# Altium schematic sheet SM2200.SchDoc
size 406 x 228 mm
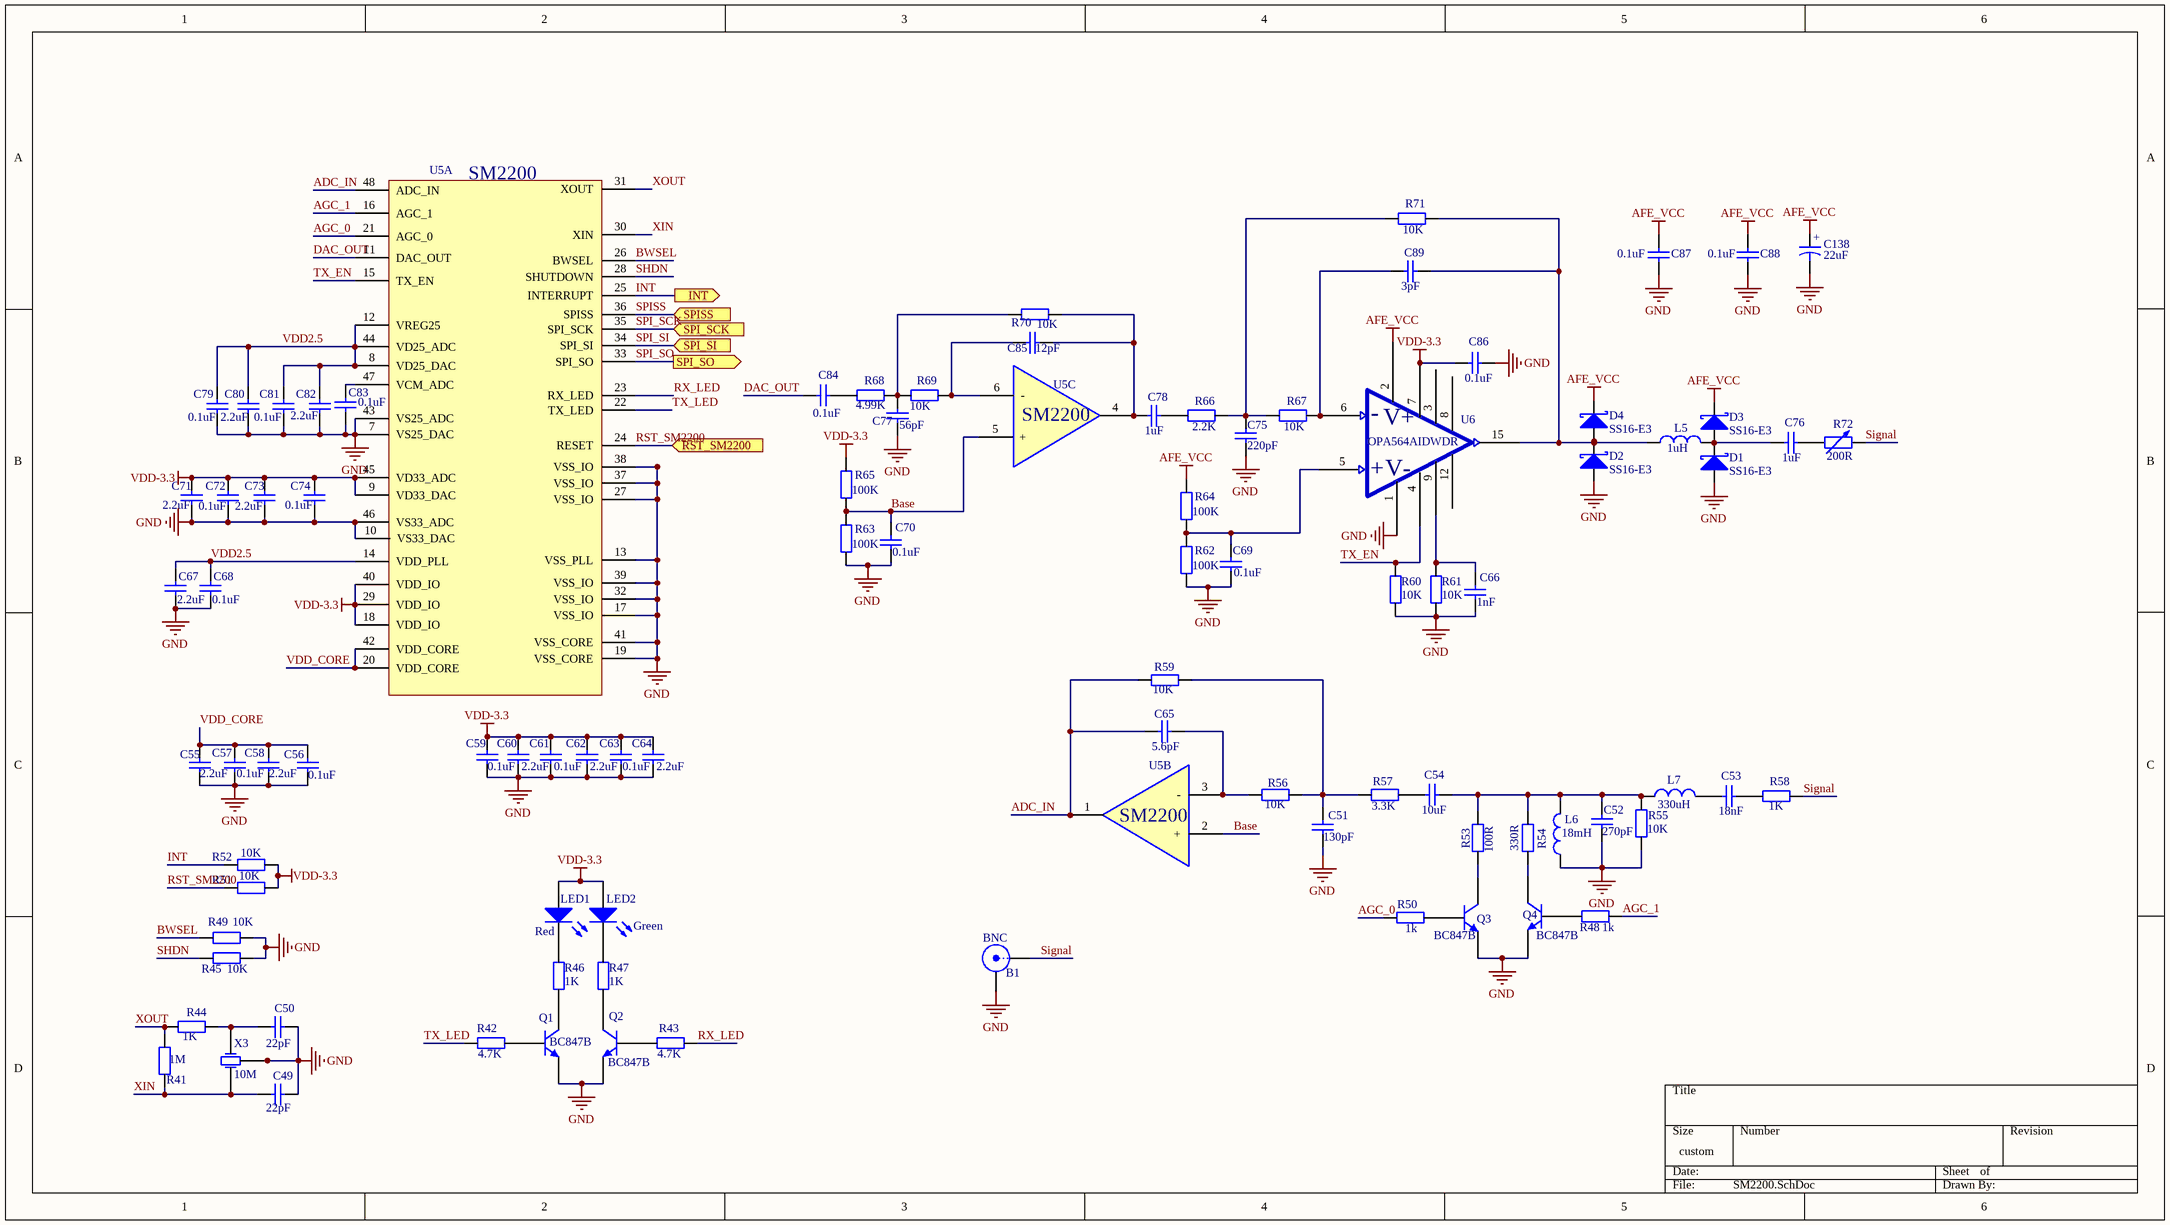
[diagram p0: SM2200.SchDoc]

## Parts
B1  BNC  [BNC]
C49  value 22pF  [0603]  (hidden comment: Capacitor-0805)
C50  value 22pF  [0603]  (hidden comment: Capacitor-0805)
C51  value 130pF  [0603]  (hidden comment: Capacitor-0603)
C52  value 270pF  [0603]  (hidden comment: Capacitor-0603)
C53  value 18nF  [0603]  (hidden comment: Capacitor-0603)
C54  value 10uF  [0805]  (hidden comment: Capacitor-0603)
C55  value 2.2uF  [0603]  (hidden comment: Capacitor-0805)
C56  value 0.1uF  [0603]  (hidden comment: Capacitor-0805)
C57  value 0.1uF  [0603]  (hidden comment: Capacitor-0805)
C58  value 2.2uF  [0603]  (hidden comment: Capacitor-0805)
C59  value 0.1uF  [0603]  (hidden comment: Capacitor-0805)
C60  value 2.2uF  [0603]  (hidden comment: Capacitor-0805)
C61  value 0.1uF  [0603]  (hidden comment: Capacitor-0805)
C62  value 2.2uF  [0603]  (hidden comment: Capacitor-0805)
C63  value 0.1uF  [0603]  (hidden comment: Capacitor-0805)
C64  value 2.2uF  [0603]  (hidden comment: Capacitor-0805)
C65  value 5.6pF  [0603]  (hidden comment: Capacitor-0603)
C66  value 1nF  [0603]  (hidden comment: Capacitor-0603)
C67  value 2.2uF  [0603]  (hidden comment: Capacitor-0805)
C68  value 0.1uF  [0603]  (hidden comment: Capacitor-0805)
C69  value 0.1uF  [0603]  (hidden comment: Capacitor-0603)
C70  value 0.1uF  [0603]  (hidden comment: Capacitor-0603)
C71  value 2.2uF  [0603]  (hidden comment: Capacitor-0805)
C72  value 0.1uF  [0603]  (hidden comment: Capacitor-0805)
C73  value 2.2uF  [0603]  (hidden comment: Capacitor-0805)
C74  value 0.1uF  [0603]  (hidden comment: Capacitor-0805)
C75  value 220pF  [0603]  (hidden comment: Capacitor-0603)
C76  value 1uF  [0603]  (hidden comment: Capacitor-0603)
C77  value 56pF  [0603]  (hidden comment: Capacitor-0603)
C78  value 1uF  [0603]  (hidden comment: Capacitor-0603)
C79  value 0.1uF  [0603]  (hidden comment: Capacitor-0805)
C80  value 2.2uF  [0603]  (hidden comment: Capacitor-0805)
C81  value 0.1uF  [0603]  (hidden comment: Capacitor-0805)
C82  value 2.2uF  [0603]  (hidden comment: Capacitor-0805)
C83  value 0.1uF  [0603]  (hidden comment: Capacitor-0805)
C84  value 0.1uF  [0603]  (hidden comment: Capacitor-0603)
C85  value 12pF  [0603]  (hidden comment: Capacitor-0603)
C86  value 0.1uF  [0603]  (hidden comment: Capacitor-0603)
C87  value 0.1uF  [0603]  (hidden comment: Capacitor-0603)
C88  value 0.1uF  [0603]  (hidden comment: Capacitor-0603)
C89  value 3pF  [0603]  (hidden comment: Capacitor-0603)
C138  value 22uF  [3528]  (hidden comment: 电解电容)
D1  Name: SS16-E3  [IN5824]  (hidden comment: SSA34)
D2  Name: SS16-E3  [IN5824]  (hidden comment: SSA34)
D3  Name: SS16-E3  [IN5824]  (hidden comment: SSA34)
D4  Name: SS16-E3  [IN5824]  (hidden comment: SSA34)
L5  value 1uH  [1206]  (hidden comment: Inductor)
L6  value 18mH  [工字电感0608]  (hidden comment: Inductor)
L7  value 330uH  [Inductor(7.8*7*5)]  (hidden comment: Inductor)
LED1  Color: Red  [外插小灯]  (hidden comment: LED)
LED2  Color: Green  [外插小灯]  (hidden comment: LED)
Q1  BC847  [BC847B]  (value not drawn)
Q2  BC847  [BC847B]  (value not drawn)
Q3  BC847  [BC847B]  (value not drawn)
Q4  BC847  [BC847B]  (value not drawn)
R41  value 1M  [0603]  (hidden comment: Resistor-0805)
R42  value 4.7K  [0603]  (hidden comment: Resistor-0805)
R43  value 4.7K  [0603]  (hidden comment: Resistor-0805)
R44  value 1K  [0603]  (hidden comment: Resistor-0805)
R45  value 10K  [0603]  (hidden comment: Resistor-0805)
R46  value 1K  [0603]  (hidden comment: Resistor-0805)
R47  value 1K  [0603]  (hidden comment: Resistor-0805)
R48  value 1k  [0603]  (hidden comment: Resistor-0603)
R49  value 10K  [0603]  (hidden comment: Resistor-0805)
R50  value 1k  [0603]  (hidden comment: Resistor-0603)
R51  value 10K  [0603]  (hidden comment: Resistor-0805)
R52  value 10K  [0603]  (hidden comment: Resistor-0805)
R53  value 100R  [0603]  (hidden comment: Resistor-0603)
R54  value 330R  [0603]  (hidden comment: Resistor-0603)
R55  value 10K  [0603]  (hidden comment: Resistor-0603)
R56  value 10K  [0603]  (hidden comment: Resistor-0603)
R57  value 3.3K  [0603]  (hidden comment: Resistor-0603)
R58  value 1K  [0603]  (hidden comment: Resistor-0603)
R59  value 10K  [0603]  (hidden comment: Resistor-0603)
R60  value 10K  [0603]  (hidden comment: Resistor-0603)
R61  value 10K  [0603]  (hidden comment: Resistor-0603)
R62  value 100K  [0603]  (hidden comment: Resistor-0603)
R63  value 100K  [0603]  (hidden comment: Resistor-0603)
R64  value 100K  [0603]  (hidden comment: Resistor-0603)
R65  value 100K  [0603]  (hidden comment: Resistor-0603)
R66  value 2.2K  [0603]  (hidden comment: Resistor-0603)
R67  value 10K  [0603]  (hidden comment: Resistor-0603)
R68  value 4.99K  [0603]  (hidden comment: Resistor-0603)
R69  value 10K  [0603]  (hidden comment: Resistor-0603)
R70  value 10K  [0603]  (hidden comment: Resistor-0603)
R71  value 10K  [0603]  (hidden comment: Resistor-0603)
R72  value 200R  [3296电位器]  (hidden comment: Res_)
U5  SM2200  [SM2200]  (parts A,B,C of 3)
U6  OPA564AIDWDR  [OPA564AIDWDR]
X3  value 10M  [3225无源晶振]  (hidden comment: 3225无源晶振)

## Ports
INT (out), RST_SM2200 (in), SPI_SCK (in), SPI_SI (in), SPI_SO (out), SPISS (in)

## Nets
AFE_VCC: C87.2 C88.2 C138.2 D3.2(K) D4.2(K) R64.2 U6.2
GND: B1.1(Y) C49.2 C50.2 C51.2 C52.2 C55.1 C56.1 C57.1 C58.1 C59.1 C60.1 C61.1 C62.1 C63.1 C64.1 C66.1 C67.1 C68.1 C69.2 C70.1 C71.1 C72.1 C73.1 C74.1 C75.2 C77.1 C79.1 C80.1 C81.1 C82.1 C83.1 C86.1 C87.1 C88.1 C138.1 D1.1(A) D2.1(A) L6.1 Q1.1(E) Q2.1(E) Q3.1(E) Q4.1(E) R45.2 R49.2 R55.1 R60.1 R61.1 R62.1 R63.1 U5.7(VS25_DAC) U5.10(VS33_DAC) U5.13(VSS_PLL) U5.17(VSS_IO) U5.19(VSS_CORE) U5.27(VSS_IO) U5.32(VSS_IO) U5.37(VSS_IO) U5.38(VSS_IO) U5.39(VSS_IO) U5.41(VSS_CORE) U5.43(VS25_ADC) U5.46(VS33_ADC) U6.1 X3.2(GND) X3.4(GND)
VDD-3.3: C59.2 C60.2 C61.2 C62.2 C63.2 C64.2 C71.2 C72.2 C73.2 C74.2 C86.2 LED1.1(A) LED2.1(A) R51.2 R52.2 R65.2 U5.9(VD33_DAC) U5.18(VDD_IO) U5.29(VDD_IO) U5.40(VDD_IO) U5.45(VD33_ADC) U6.7
ADC_IN: C65.1 R59.2 U5.1 U5.48(ADC_IN)
AGC_0: R50.2 U5.21(AGC_0)
AGC_1: R48.2 U5.16(AGC_1)
Base: C70.2 R63.2 R65.1 U5.2(+) U5.5(+)
BWSEL: R49.1 U5.26(BWSEL)
DAC_OUT: C84.2 U5.11(DAC_OUT)
INT: R52.1 U5.25(INTERRUPT) ; port INT
RST_SM2200: R51.1 U5.24(RESET) ; port RST_SM2200
RX_LED: R43.1 U5.23(RX_LED)
SHDN: R45.1 U5.28(SHUTDOWN)
Signal: B1.2(X) R58.2 R72.2
SPI_SCK: U5.35(SPI_SCK) ; port SPI_SCK
SPI_SI: U5.34(SPI_SI) ; port SPI_SI
SPI_SO: U5.33(SPI_SO) ; port SPI_SO
SPISS: U5.36(SPISS) ; port SPISS
TX_EN: R60.2 U5.15(TX_EN) U6.4
TX_LED: R42.2 U5.22(TX_LED)
VDD2.5: C67.2 C68.2 C79.2 C80.2 C81.2 C82.2 U5.8(VD25_DAC) U5.12(VREG25) U5.14(VDD_PLL) U5.44(VD25_ADC)
VDD_CORE: C55.2 C56.2 C57.2 C58.2 U5.20(VDD_CORE) U5.42(VDD_CORE)
XIN: C49.1 R41.1 U5.30(XIN) X3.1(OSC1)
XOUT: R41.2 R44.1 U5.31(XOUT)
NetC50_1: C50.1 R44.2 X3.3(OSC2)
NetC51_1: C51.1 R56.1 R57.2 R59.1
NetC52_1: C52.1 C54.1 L6.2 L7.1 R53.2 R54.2 R55.2
NetC53_1: C53.1 R58.1
NetC53_2: C53.2 L7.2
NetC54_2: C54.2 R57.1
NetC65_2: C65.2 R56.2 U5.3(-)
NetC66_2: C66.2 R61.2 U6.9
NetC69_1: C69.1 R62.2 R64.1 U6.5
NetC75_1: C75.1 R66.2 R67.1 R71.1
NetC76_1: C76.1 R72.1
NetC76_2: C76.2 D1.2(K) D3.1(A) L5.2
NetC77_2: C77.2 R68.2 R69.1 R70.1
NetC78_1: C78.1 R66.1
NetC78_2: C78.2 C85.1 R70.2 U5.4
NetC83_2: C83.2 U5.47(VCM_ADC)
NetC84_1: C84.1 R68.1
NetC85_2: C85.2 R69.2 U5.6(-)
NetC89_1: C89.1 D2.2(K) D4.1(A) L5.1 R71.2 U6.15
NetC89_2: C89.2 R67.2 U6.6
NetLED1_2: LED1.2 R46.2
NetLED2_2: LED2.2 R47.2
NetQ1_2: Q1.2(B) R42.1
NetQ1_3: Q1.3(C) R46.1
NetQ2_2: Q2.2(B) R43.2
NetQ2_3: Q2.3(C) R47.1
NetQ3_2: Q3.2(B) R50.1
NetQ3_3: Q3.3(C) R53.1
NetQ4_2: Q4.2(B) R48.1
NetQ4_3: Q4.3(C) R54.1

Not connected (* = marked no-connect by the designer): U6 3 8 12

## Notes on the sheet
- (in symbol OPA564AIDWDR) -; V+; +; V-
- (in symbol 电解电容) +

## Library data of the parts
C49 C50 C55-C64 C67 C68 C71-C74 C79-C83 = Capacito
R41-R47 R49 R51 R52 = Resisto
U6 = OPA564AIDWDR: pin to pad: 1>1+10+11+20+13+14; Name: OPA564AIDWDR
B1 = BNC: Name: BNC
LED1 LED2 = LED: Value: LED
Q1-Q4 = BC847: Name: BC847B
R72 = Res_: Name: 3296电位器